# EAGLE board LaserCutter (EAGLE 6.2)
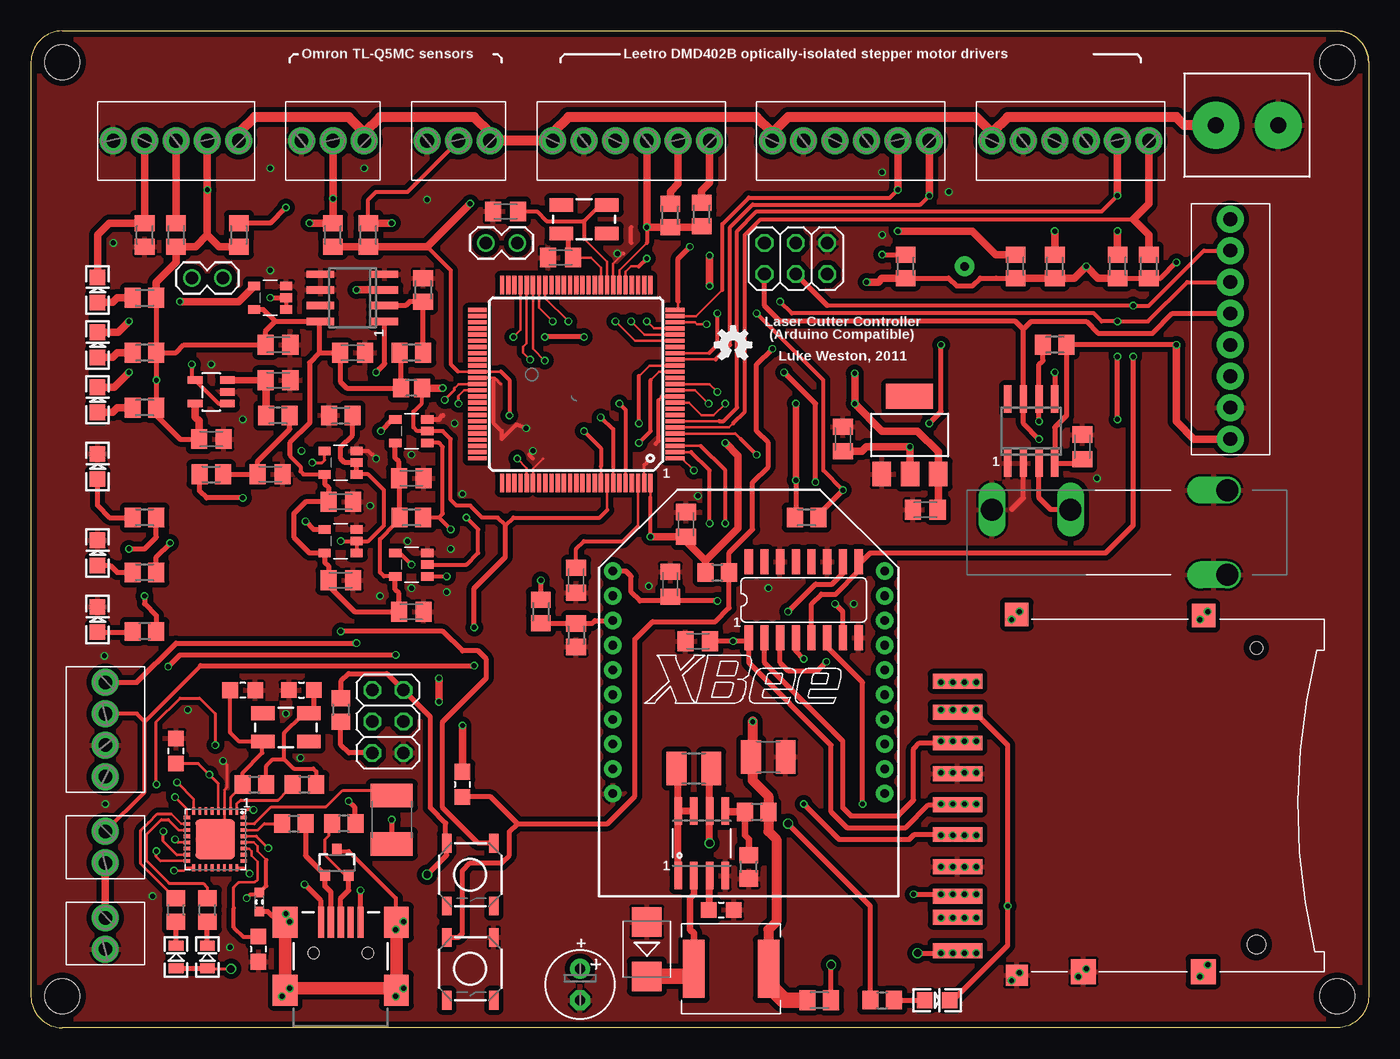
[diagram p5: board, top side]
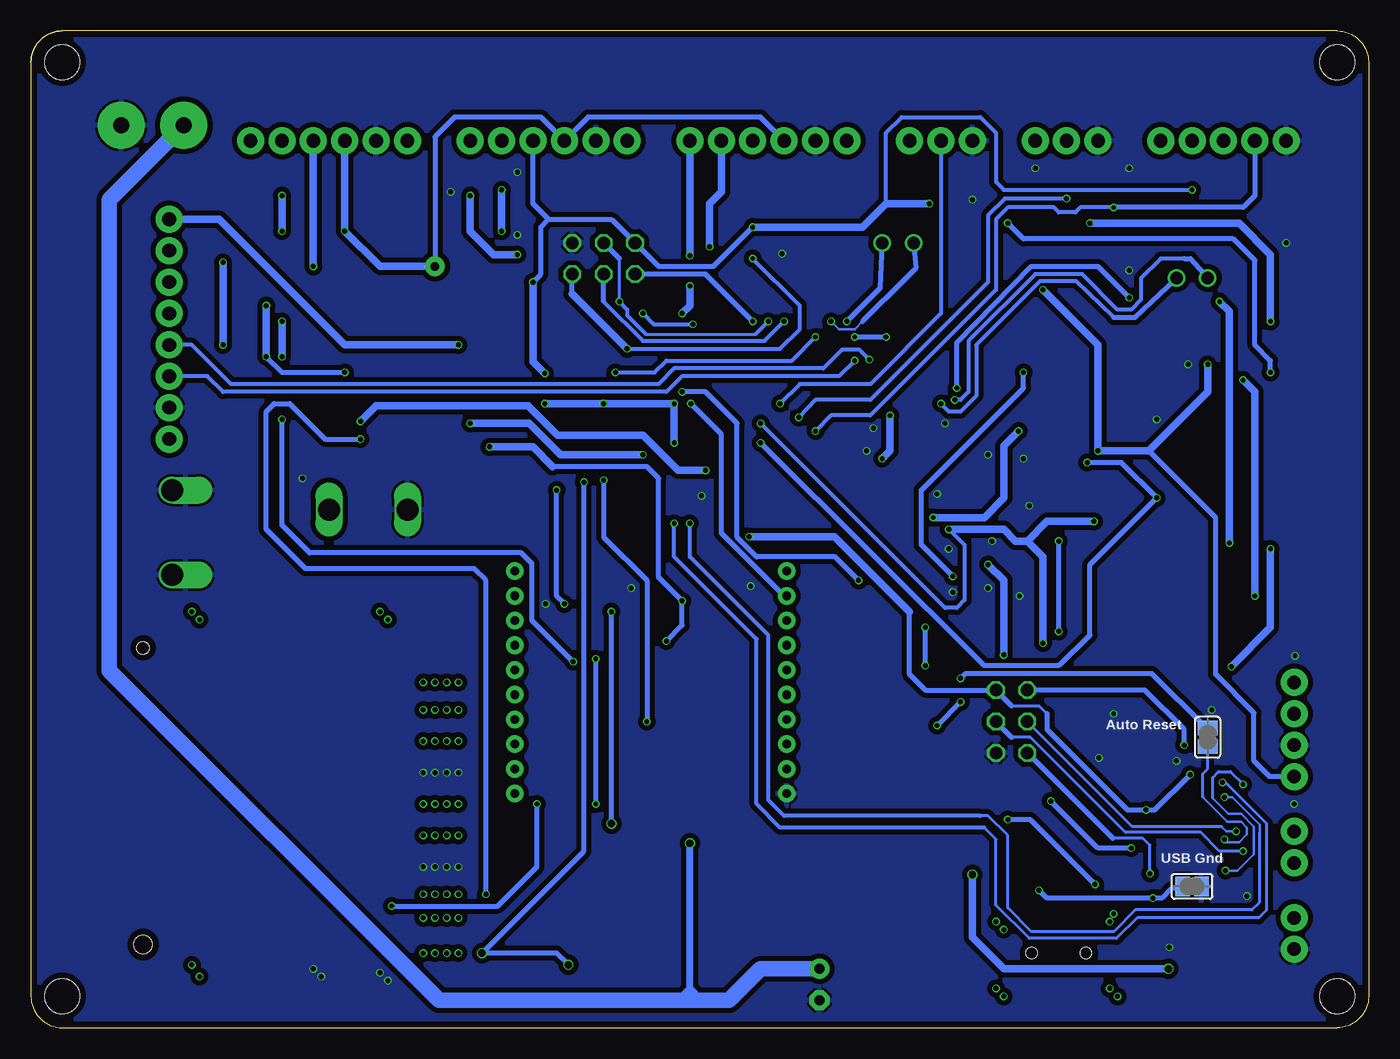
[diagram p6: board, bottom side, seen from below]

Size 108.27 x 80.64 mm. Coordinates in mm from the lower left corner, seen from the top.
Outline: 108.27,78.11 arc90 105.73,80.64
Outline: 105.73,80.64 arc-90 108.27,78.11
Outline: 108.27,78.11 108.27,2.54 arc-90 105.73,0 2.54,0 arc-90 0,2.54 0,78.11 arc-90 2.54,80.64 105.73,80.64
Copper layers (1*16): Top 0.035mm / dielectric 1.5mm / Bottom 0.035mm
Design rules: minimum track width 8mil, minimum drill 0.3mm, track to track 8mil, track to pad 8mil, pad to pad 8mil, via to via 8mil, smd to smd 8mil, copper to edge 20mil, drill to drill 8mil, minimum pad ring 8mil, minimum via ring 4mil, stop-mask expansion 3mil, vias tented up to drill 25mil, thermal gap 8mil
Holes 2.8 mm at 2.54,2.54 105.73,2.54 2.54,78.11 105.73,78.11

## Footprints (pad centres in the part's own frame; a part is rotated, then mirrored left to right if it is on the bottom)
0805-LARGE = smd 1.27 x 1.27: 1 -1.016,0; 2 1.016,0
C0805K = smd 1.3 x 1.6: 1 -1,0; 2 1,0
E2,5-6 = drill 0.813 pad 1.6: + -1.27,0 | drill 0.813 pad 1.6 octagon: - 1.27,0
C1210 = smd 1.6 x 2.7: 1 -1.4,0; 2 1.4,0
SMB = smd 2.4 x 2.4: A 2.2,0; C -2.2,0
1812 = smd 1.9 x 3.4: 1 -1.95,0; 2 1.95,0
ATMEL_QFN32 = smd 0.6 x 0.3: 1 -2.3,1.75; 2 -2.3,1.25; 3 -2.3,0.75; 4 -2.3,0.25; 5 -2.3,-0.25; 6 -2.3,-0.75; 7 -2.3,-1.25; 8 -2.3,-1.75; 17 2.3,-1.75; 18 2.3,-1.25; 19 2.3,-0.75; 20 2.3,-0.25; 21 2.3,0.25; 22 2.3,0.75; 23 2.3,1.25; 24 2.3,1.75 | smd 0.3 x 0.6: 9 -1.75,-2.3; 10 -1.25,-2.3; 11 -0.75,-2.3; 12 -0.25,-2.3; 13 0.25,-2.3; 14 0.75,-2.3; 15 1.25,-2.3; 16 1.75,-2.3; 25 1.75,2.3; 26 1.25,2.3; 27 0.75,2.3; 28 0.25,2.3; 29 -0.25,2.3; 30 -0.75,2.3; 31 -1.25,2.3; 32 -1.75,2.3 | smd 3.2 x 3.2: EXP 0,0
XBEE-PRO = drill 0.7 pad 1.422: 1 -11,10.27; 2 -11,8.27; 3 -11,6.27; 4 -11,4.27; 5 -11,2.27; 6 -11,0.27; 7 -11,-1.73; 8 -11,-3.73; 9 -11,-5.73; 10 -11,-7.73; 11 11,-7.73; 12 11,-5.73; 13 11,-3.73; 14 11,-1.73; 15 11,0.27; 16 11,2.27; 17 11,4.27; 18 11,6.27; 19 11,8.27; 20 11,10.27
SO08 = smd 0.61 x 2.21: 1 -1.905,-2.616; 2 -0.635,-2.616; 3 0.635,-2.616; 4 1.905,-2.616; 5 1.905,2.616; 6 0.635,2.616; 7 -0.635,2.616; 8 -1.905,2.616
SOT23-5 = smd 0.69 x 0.99: 1 -0.95,-1.29; 2 0,-1.29; 3 0.95,-1.29; 4 0.95,1.3; 5 -0.95,1.3
TQFP100 = smd 1.5 x 0.35: 1 -8,6; 2 -8,5.5; 3 -8,5; 4 -8,4.5; 5 -8,4; 6 -8,3.5; 7 -8,3; 8 -8,2.5; 9 -8,2; 10 -8,1.5; 11 -8,1; 12 -8,0.5; 13 -8,0; 14 -8,-0.5; 15 -8,-1; 16 -8,-1.5; 17 -8,-2; 18 -8,-2.5; 19 -8,-3; 20 -8,-3.5; 21 -8,-4; 22 -8,-4.5; 23 -8,-5; 24 -8,-5.5; 25 -8,-6; 51 8,-6; 52 8,-5.5; 53 8,-5; 54 8,-4.5; 55 8,-4; 56 8,-3.5; 57 8,-3; 58 8,-2.5; 59 8,-2; 60 8,-1.5; 61 8,-1; 62 8,-0.5; 63 8,0; 64 8,0.5; 65 8,1; 66 8,1.5; 67 8,2; 68 8,2.5; 69 8,3; 70 8,3.5; 71 8,4; 72 8,4.5; 73 8,5; 74 8,5.5; 75 8,6 | smd 0.35 x 1.5: 26 -6,-8; 27 -5.5,-8; 28 -5,-8; 29 -4.5,-8; 30 -4,-8; 31 -3.5,-8; 32 -3,-8; 33 -2.5,-8; 34 -2,-8; 35 -1.5,-8; 36 -1,-8; 37 -0.5,-8; 38 0,-8; 39 0.5,-8; 40 1,-8; 41 1.5,-8; 42 2,-8; 43 2.5,-8; 44 3,-8; 45 3.5,-8; 46 4,-8; 47 4.5,-8; 48 5,-8; 49 5.5,-8; 50 6,-8; 76 6,8; 77 5.5,8; 78 5,8; 79 4.5,8; 80 4,8; 81 3.5,8; 82 3,8; 83 2.5,8; 84 2,8; 85 1.5,8; 86 1,8; 87 0.5,8; 88 0,8; 89 -0.5,8; 90 -1,8; 91 -1.5,8; 92 -2,8; 93 -2.5,8; 94 -3,8; 95 -3.5,8; 96 -4,8; 97 -4.5,8; 98 -5,8; 99 -5.5,8; 100 -6,8
SO16 = smd 0.66 x 2.032: 1 -4.445,-3.073; 2 -3.175,-3.073; 3 -1.905,-3.073; 4 -0.635,-3.073; 5 0.635,-3.073; 6 1.905,-3.073; 7 3.175,-3.073; 8 4.445,-3.073; 9 4.445,3.073; 10 3.175,3.073; 11 1.905,3.073; 12 0.635,3.073; 13 -0.635,3.073; 14 -1.905,3.073; 15 -3.175,3.073; 16 -4.445,3.073
SOT223 = smd 1.499 x 2.007: 1 -2.261,-3.15; 2 0.025,-3.15; 3 2.311,-3.15 | smd 3.81 x 2.007: 4 0,3.15
SOT23-5' = smd 0.6 x 1.2: 1 -0.95,-1.306; 2 0,-1.306; 3 0.95,-1.306; 4 0.95,1.306; 5 -0.95,1.306
SO08' = smd 0.6 x 2.2: 1 -1.905,-2.6; 2 -0.635,-2.6; 3 0.635,-2.6; 4 1.905,-2.6; 5 1.905,2.6; 6 0.635,2.6; 7 -0.635,2.6; 8 -1.905,2.6
SOIC8-2 = smd 0.6 x 2.2: 1 -1.905,-2.6; 2 -0.635,-2.6; 3 0.635,-2.6; 4 1.905,-2.6; 5 1.905,2.6; 6 0.635,2.6; 7 -0.635,2.6; 8 -1.905,2.6
6POL254 = drill 1.1 pad 2.184: 1 -6.35,0; 2 -3.81,0; 3 -1.27,0; 4 1.27,0; 5 3.81,0; 6 6.35,0
SJ = smd 1.168 x 1.6: 1 -0.762,0; 2 0.762,0
USB-MINIB-FT = smd 2.5 x 0.5: D+ 2.5,0; D- 2.5,0.8; GND 2.5,-1.6; ID 2.5,-0.8; VBUS 2.5,1.6 | smd 2.5 x 2: SH1 -3,-4.5; SH2 -3,4.5; SH3 2.5,4.5; SH4 2.5,-4.5 | hole 0.9: 0,2.2; 0,-2.2
2X03 = drill 1.016 octagon: 1 -2.54,-1.27; 2 -2.54,1.27; 3 0,-1.27; 4 0,1.27; 5 2.54,-1.27; 6 2.54,1.27
1,6/0,8 = drill 0.7 pad 1.6: 1 0,0
4POL254 = drill 1.1 pad 2.184: 1 -3.81,0; 2 -1.27,0; 3 1.27,0; 4 3.81,0
W237-132 = drill 1.3 pad 3.81: 1 -2.54,0; 2 2.54,0
8POL254 = drill 1.1 pad 2.184: 1 -8.89,0; 2 -6.35,0; 3 -3.81,0; 4 -1.27,0; 5 1.27,0; 6 3.81,0; 7 6.35,0; 8 8.89,0
1X02 = drill 1.016: 1 0,0; 2 2.54,0
SDCARD = smd 1.2 x 4: 1 6.8,0.89; 2 4.3,0.89; 3 1.8,0.89; 4 -0.7,0.89; 5 -3.1,0.89; 6 -5.7,0.89; 7 -8.1,0.89; 8 -9.8,0.89; 9 9.3,0.89; CD -12.5,0.89 | smd 2.032 x 2.032: COM -14.2,-9.3; WP -14.2,-19 | smd 1.7 x 1.8: MT1 -14.5,-3.91 | smd 1.9 x 1.9: MT2 14.7,-3.91; MT3 14.6,-19.01 | hole 1.5: -12,-23.31 | hole 1: 12,-23.31
3POL254 = drill 1.1 pad 2.184: 1 -2.54,0; 2 0,0; 3 2.54,0
5POL254 = drill 1.1 pad 2.184: 1 -5.08,0; 2 -2.54,0; 3 0,0; 4 2.54,0; 5 5.08,0
2POL254 = drill 1.1 pad 2.184: 1 -1.27,0; 2 1.27,0
PCC-SMP-V = drill 1.778 offset: P$1 -4.013,-5.08; P$2 2.845,-5.08 | drill 1.778 long: T+ 1.27,7.62; T- 1.27,13.97
0603 = smd 0.762 x 0.762: 1 -0.762,0; 2 0.762,0
CR75 = smd 1.75 x 4.7: P$1 0,0; P$2 6.05,0
LED-0805 = smd 0.8 x 1.2: A -0.9,0; C 0.9,0
LED-0805-LARGE = smd 1.27 x 1.27: A -1.016,0; C 1.016,0
CRYSTAL-SMD-5X3 = smd 1.9 x 1.1: 1 -1.85,-1.15; 2 1.85,-1.15; 3 1.85,1.15; 4 -1.85,1.15
R0805 = smd 1.3 x 1.5: 1 -0.95,0; 2 0.95,0
M0805 = smd 1.3 x 1.6: 1 -0.95,0; 2 0.95,0
R1210 = smd 1.6 x 2.7: 1 -1.4,0; 2 1.4,0
R0805' = smd 1.3 x 1.5: 1 -0.85,0; 2 0.85,0
TACTILE_SWITCH_SMD = smd 1.524 x 0.762: 1 -2.54,1.905; 2 2.54,1.905; 3 -2.54,-1.905; 4 2.54,-1.905
SOT23-3 = smd 0.8 x 0.9: 1 -0.95,-1; 2 0.95,-1; 3 0,1.1

## Placement (x,y rotation side)
$1  OSHW-LOGOS  [OSHW-LOGO-S]  56.83,55.24 0 top
C1  22pF  [0805-LARGE]  17.14,27.3 180 top
C2  22pF  [0805-LARGE]  21.9,27.31 0 top
C3  100nF  [0805-LARGE]  34.92,19.68 270 top
C4  100nF  [C0805K]  51.75,35.88 90 top
C5  100nF  [0805-LARGE]  11.75,22.38 90 top
C6  1uF  [0805-LARGE]  18.41,6.35 270 top
C7  22pF  [C0805K]  38.42,66.04 0 top
C8  22pF  [C0805K]  42.86,62.31 0 top
C9  100 uF  [E2,5-6]  44.45,3.49 270 top
C10  47 uF  [C1210]  59.69,21.91 0 top
C11  100 pF  [0805-LARGE]  55.88,9.53 0 top
C12  100nF  [C0805K]  53.02,40.72 270 top
C13  100nF  [C0805K]  44.13,36.2 90 top
C14  100nF  [C0805K]  72.39,41.91 180 top
C15  10 uF  [C0805K]  65.72,47.62 90 top
C16  100nF  [C0805K]  53.98,31.27 180 top
C17  100nF  [C0805K]  19.37,44.77 0 top
C18  100nF  [C0805K]  20,52.39 0 top
C19  100nF  [C0805K]  85.09,46.99 90 top
C20  100nF  [C0805K]  20,55.24 0 top
C21  100nF  [C0805K]  30.8,44.45 0 top
C22  100nF  [C0805K]  30.8,33.66 0 top
C23  100nF  [C0805K]  25.08,36.2 0 top
C24  100nF  [C0805K]  25.08,42.55 0 top
C25  100nF  [C0805K]  14.61,47.62 0 top
C26  100nF  [C0805K]  26.04,54.61 0 top
D1  CDBB260  [SMB]  49.85,6.35 90 top
F1  500 mA  [1812]  29.21,16.83 90 top
IC1  ATMEGA8U2  [ATMEL_QFN32]  14.92,15.24 270 top
IC2  BEE module  [XBEE-PRO]  58.1,26.67 0 top
IC3  MC34063  [SO08]  54.29,14.92 0 top
IC4  74AHC1G02DBV  [SOT23-5]  19.37,59.05 90 top
IC5  74AHC1G08DBV  [SOT23-5]  30.8,37.47 90 top
IC6  ATMEGA2560-16AU  [TQFP100]  44.13,52.07 180 top
IC7  CD4050D  [SO16]  62.55,34.61 0 top
IC8  LD1117S33  [SOT223]  71.12,47.94 0 top
IC9  OPA340N  [SOT23-5']  14.61,51.44 90 top
IC10  LM393D  [SO08']  26.04,59.05 90 top
IC11  74AHC1G02DBV  [SOT23-5]  25.08,39.37 90 top
IC12  74AHC1G02DBV  [SOT23-5]  30.8,48.26 90 top
IC13  74AHC1G08DBV  [SOT23-5]  25.08,45.72 90 top
IC14  MAX6675  [SOIC8-2]  80.96,48.26 0 top
J1  X Stepper  [6POL254]  48.58,71.75 180 top
J2  Reset En  [SJ]  13.02,23.5 90 bottom
J3  USB  [USB-MINIB-FT]  25.08,6.03 90 top
J4  Y Stepper  [6POL254]  66.36,71.75 180 top
J5  Ground  [SJ]  14.29,11.43 0 bottom
J6  ISP  [2X03]  28.89,24.77 270 top
J7  Z Stepper  [6POL254]  84.14,71.75 180 top
J8  Stepper disable  [1,6/0,8]  75.56,61.59 0 top
J9  Laser HV PSU  [4POL254]  6.03,24.13 270 top
J10  24V in  [W237-132]  98.43,73.03 0 top
J11  Interface  [8POL254]  97.08,56.51 90 top
J12  I2C  [1X02]  39.37,63.5 180 top
J13  SDMMC18650  [SDCARD]  75.88,18.73 90 top
J14  ISP  [2X03]  61.91,62.23 0 top
J15  UART3  [1X02]  13.02,60.64 0 top
J16  X Home  [3POL254]  34.61,71.75 180 top
J17  Z Home  [5POL254]  11.75,71.75 180 top
J18  Y Home  [3POL254]  24.45,71.75 180 top
J19  Interlocks  [2POL254]  6.03,14.61 270 top
J20  Spare  [2POL254]  6.03,7.62 270 top
J21  Omega PCC-SMP-V-K  [PCC-SMP-V]  91.76,40.64 90 top
L1  L1: 0603 Ferrite bead  [0603]  18.49,10.16 90 top
L2  33 uH  [CR75]  53.66,4.76 0 top
LED1  TXD  [LED-0805]  14.29,5.71 90 top
LED2  RXD  [LED-0805]  11.75,5.72 90 top
LED3  Power  [LED-0805-LARGE]  5.4,33.02 90 top
LED4  Laser On  [LED-0805-LARGE]  5.4,45.4 90 top
LED5  Interlocks  [LED-0805-LARGE]  5.4,38.42 90 top
LED6  SDBusy  [LED-0805-LARGE]  73.34,2.22 0 top
LED7  XHome  [LED-0805-LARGE]  5.4,50.8 90 top
LED8  ZHome  [LED-0805-LARGE]  5.4,59.69 90 top
LED9  YHome  [LED-0805-LARGE]  5.4,55.24 90 top
Q1  16 MHz  [CRYSTAL-SMD-5X3]  20.64,24.29 180 top
Q2  16MHz  [CRYSTAL-SMD-5X3]  44.77,65.41 0 top
R1  10k  [R0805]  25.08,25.72 270 top
R2  10k  [M0805]  51.75,65.72 270 top
R3  10k  [M0805]  82.87,61.59 270 top
R4  10k  [M0805]  54.29,65.8 270 top
R5  10k  [M0805]  70.8,61.59 270 top
R6  10k  [M0805]  79.69,61.59 270 top
R7  10k  [M0805]  90.49,61.59 270 top
R8  10k  [M0805]  87.95,61.59 270 top
R9  1M  [R0805]  18.1,19.68 0 top
R10  5k6  [M0805]  41.27,33.66 90 top
R11  27R  [R0805]  22.15,19.68 0 top
R12  10k  [M0805]  44.13,31.75 90 top
R13  1k  [R0805]  14.29,9.53 90 top
R14  22R  [R0805]  21.27,16.51 0 top
R15  1k  [R0805]  11.75,9.53 90 top
R16  22 R  [R0805]  25.32,16.51 180 top
R17  10k  [R0805]  55.56,36.83 0 top
R18  0.2 ohm  [R1210]  53.66,20.95 180 top
R19  1k  [R0805]  9.21,32.07 180 top
R20  1k  [R0805]  58.1,13.02 90 top
R21  3k0  [R0805]  58.74,17.46 0 top
R22  1k  [M0805]  9.21,41.27 0 top
R23  1k  [M0805]  9.21,36.83 0 top
R24  10k  [M0805]  63.82,2.22 0 top
R25  10k  [M0805]  62.79,41.27 0 top
R26  1k  [R0805]  68.9,2.22 0 top
R27  1k  [M0805]  9.21,50.16 0 top
R28  10k  [R0805']  30.8,51.75 180 top
R29  10k  [M0805]  30.8,41.27 0 top
R30  10k  [M0805]  30.8,54.61 0 top
R31  10k  [M0805]  27.3,64.14 270 top
R32  10k  [M0805]  24.45,64.14 270 top
R33  1k  [M0805]  9.21,54.61 0 top
R34  220R  [M0805]  11.75,64.14 90 top
R35  10k  [M0805]  16.83,64.14 90 top
R36  1k  [M0805]  9.21,59.05 180 top
R37  1k  [M0805]  14.61,44.77 180 top
R38  1k  [M0805]  20,49.53 0 top
R39  DNP  [M0805]  9.21,64.14 270 top
R40  10k  [M0805]  82.87,55.24 0 top
R41  1k  [M0805]  31.75,59.69 90 top
R42  10k  [M0805]  25.08,49.53 180 top
S1  Reset  [TACTILE_SWITCH_SMD]  35.56,4.76 270 top
S2  Laser Test  [TACTILE_SWITCH_SMD]  35.56,12.38 270 top
U$  OSHW-LOGOS  [OSHW-LOGO-S]  56.83,55.24 0 top
U$1  OSHW-LOGOS  [OSHW-LOGO-S]  56.83,55.24 0 top
U$2  OSHW-LOGOS  [OSHW-LOGO-S]  56.83,55.24 0 top
U$3  OSHW-LOGOS  [OSHW-LOGO-S]  56.83,55.24 0 top
Z1  PGB102ST23  [SOT23-3]  24.77,13.34 0 top

## Tracks (layer width: path | path; a pad name or v marks a point on that pad's centre or on a via)
8U2_MISO  (via drill 0.4)
  Top 0.203: IC1.17 12.62,12.94 12.38,12.7 v11.59,12.7
  Top 0.254: v10.16,19.68 10.16,24.77 12.06,26.67 13.65,26.67 14.92,25.4 v14.92,22.86
  Bottom 0.203: v11.59,12.7 10.64,12.7 9.29,14.05 9.29,16.27 10.32,17.3 11.35,17.3 12.62,18.57
  Bottom 0.254: v10.16,19.68 11.19,20.72 12.14,20.72 12.62,20.24 12.62,18.57
  Bottom 0.406: v14.92,22.86 14.92,24.13 18.1,27.3 J6.1
8U2_MOSI  (via drill 0.4)
  Top 0.203: IC1.16 10.48,13.49
  Top 0.254: 10.48,13.49 10.16,13.81 v10.16,14.29
  Bottom 0.254: v10.16,14.29 12.06,14.29 13.57,15.8 19.68,15.8 27.38,23.5 28.89,23.5
  Bottom 0.406: 28.89,23.5 J6.4
8U2_SCK  (via drill 0.4)
  Top 0.203: IC1.15 11.81,13.99
  Top 0.254: 11.81,13.99 10.72,15.08 v10.72,15.88
  Bottom 0.203: 11.91,16.27 11.51,15.88 10.87,15.88
  Bottom 0.254: v10.72,15.88 10.87,15.88 | 11.91,16.27 19.13,16.27 J6.3
!8U2_RESET  (via drill 0.4)
  Top 0.203: IC1.24 17.22,12.94 v17.7,12.46
  Top 0.406: R1.2 25.08,22.86 25.72,22.23 J6.5
  Bottom 0.254: 20.72,15.32 18.26,15.32 17.7,14.76 v17.7,12.46
  Bottom 0.406: 20.72,15.32 J6.5
!DOOR  (via drill 0.4)
  Top 0.203: 46.63,41.87 IC6.93
  Top 0.305: 9.21,24.77 9.21,19.05 J19.1 | 9.21,24.77 8.57,25.4 J9.2 | R28.1 31.65,50.54 30.96,49.85 30.96,48.58 31.27,48.26 IC12.2 33.34,48.26 33.97,47.62 33.97,42.7 34.45,42.23 35.56,42.23 36.51,41.27 37.78,41.27 38.42,40.64 39.05,41.27 46.04,41.27 46.63,41.87 | 9.21,24.77 13.73,29.29 | IC4.2 IC4.1
  Top 0.406: 38.42,40.64 38.42,38.1 35.88,35.56 v35.88,32.38 | 13.73,29.29 v35.88,29.29 | v19.37,59.05 IC4.2
  Top 0.61: R28.1 v33.34,51.75
  Bottom 0.406: v33.34,51.75 33.34,55.4 27.3,61.59 21.91,61.59 v19.37,59.05 | v35.88,29.29 v35.88,32.38
!LASER_ENABLE  (via drill 0.4)
  Top 0.203: IC6.16 50.08,53.57 49.21,52.7
  Top 0.305: 33.02,41.27 R29.2 | 33.02,41.27 33.34,41.59 33.34,46.99 33.02,47.31 IC12.1 | v33.97,40.32 33.02,41.27 | v49.21,48.9 49.21,52.7
  Top 0.406: IC11.4 22.86,40.32 v22.23,40.96 | v26.35,31.11 11.75,31.11 8.57,27.94 J9.1
  Bottom 0.305: v33.97,40.32 32.7,39.05 32.7,34.61 33.34,33.97 34.29,33.97 v49.21,48.9
  Bottom 0.61: v22.23,40.96 26.04,40.96 27.62,39.37 | 27.62,39.37 26.35,38.1 v26.35,31.11 | 27.62,39.37 28.57,39.37 29.53,40.32 v33.97,40.32
!RESET  (via drill 0.4)
  Top 0.203: IC6.30 48.13,61.15 48.58,61.59 49.21,61.59
  Top 0.305: R17.2 | v49.85,62.23 49.21,61.59
  Top 0.406: R17.2 56.52,33.97 55.4,32.86 50.32,32.86 48.9,31.43 48.9,18.73 46.67,16.51 39.37,16.51 | v60.01,54.93 58.74,53.66 58.74,48.26 59.69,47.31 59.69,45.4 58.42,44.13 58.42,40.32 56.51,38.41 R17.2 | S1.3 34.61,7.3 34.92,7.62 34.92,12.7 35.56,13.34 38.1,13.34 38.73,13.97 38.73,15.88 39.37,16.51 | C3.2 37.21,18.67 39.37,16.51
  Bottom 0.305: v49.85,62.23 46.04,58.42 46.04,56.52 47.62,54.93 v60.01,54.93
  Bottom 0.406: 64.45,59.37 J14.5
  Bottom 0.61: v60.01,54.93 64.45,59.37
!SD_CD  (via drill 0.4, 0.6)
  Top 0.203: IC6.47 39.63,56.46 v39.05,55.88
  Top 0.406: v60.96,53.02 63.5,50.48 v63.5,44.13 | v44.77,55.88 v41.59,55.88 | v71.75,6.03 v73.66,6.03 v74.61,6.03 74.79,6.03 | 74.79,6.03 J13.CD | R24.2 v64.77,5.08 | 74.79,6.03 v75.56,6.03 v76.52,6.03
  Bottom 0.305: v60.96,53.02 57.78,53.02 56.83,53.98 46.67,53.98 v44.77,55.88
  Bottom 0.406: v41.59,55.88 v39.05,55.88 | v63.5,44.13 63.5,14.29 v71.75,6.03 65.72,6.03 v64.77,5.08
!SD_CS  (via drill 0.4)
  Top 0.203: IC6.23 53.74,57.07 53.9,56.91 v54.69,56.91
  Top 0.305: v58.74,57.78 64.14,52.39 64.14,45.09 v65.72,43.5
  Top 0.406: IC7.7 65.72,33.66 v65.09,34.29 | R25.2 63.74,41.51 v65.72,43.5
  Bottom 0.305: v54.69,56.91 57.86,56.91 v58.74,57.78
  Bottom 0.406: v65.72,43.5 65.72,34.92 v65.09,34.29
!THERM_CS  (via drill 0.4)
  Top 0.203: 52.67,46.07 v53.66,45.09
  Top 0.305: IC6.1 52.67,46.07 | R40.1
  Top 0.406: R40.1 81.92,53.98 81.6,53.66 IC14.6 v81.6,49.05
  Bottom 0.61: v53.66,45.09 55.88,45.09 58.74,47.94 65.64,47.94 68.02,50.32 80.33,50.32 v81.6,49.05
!UI_CS  (via drill 0.4)
  Top 0.203: IC6.5 57.02,48.07
  Top 0.254: 57.02,48.07 57.47,47.62
  Top 0.305: 57.47,47.62 v58.74,46.35
  Top 0.406: v72.71,48.9 73.66,49.85 v73.66,55.24
  Bottom 0.61: v73.66,55.24 82.87,55.24 93.03,65.41 96.76,65.41 J11.8 | v72.71,48.9 67.94,48.9 65.41,46.35 v58.74,46.35
+3V3  (via drill 0.4)
  Top 0.406: C16.1 55.09,31.27 55.24,31.43 | C16.1 v56.83,31.27 57.84,31.27 IC7.1 58.05,31.3 58.05,31.38 58.1,31.43 58.1,29.53 64.77,22.86 64.77,17.46 66.04,16.19 70.8,16.19 72.64,18.03 J13.4 | C16.1 | IC2.1 48.15,36.94 48.58,36.51 48.58,35.24 49.29,34.53 51.4,34.53 C4.1 | C4.1 51.8,34.92 | v55.56,34.53 52.1,34.53 C4.1 | v73.66,18.1 v74.61,18.1 74.61,18.03 J13.4 | J13.4 75.56,18.03 v75.56,18.1 v76.52,18.1
  Top 0.61: C15.1 67.26,46.62 67.63,46.99 v71.14,46.99 IC8.2
  Bottom 0.406: 66.04,45.4 58.42,45.4 57.47,44.45 57.47,36.43 v55.56,34.53 55.56,32.54 v56.83,31.27
  Bottom 0.61: v71.14,46.99 70.17,46.99 67.63,46.99 66.04,45.4
+5V  (via drill 0.4, 0.6)
  Top 0.203: 34.56,53.07 IC6.61 38.05,53.07 | IC6.80 40.13,45.27 v39.37,46.04 | IC6.31 47.63,61.28 49.85,63.5 | IC6.10 53.25,50.57 54.29,49.53 55.24,49.53 v56.2,50.48 | IC1.32 17.22,17.38 17.46,17.62 | 15.17,19.75 IC1.4 | 50.13,42.9 IC6.100
  Top 0.254: v18.02,17.62 17.46,17.62 | v14.45,20.48 15.16,19.76 15.16,19.77 15.08,19.84 | 15.17,19.75 14.76,20.16 | 15.17,19.75 | v14.45,20.48 15.17,19.75 | 13.56,21.37 C5.1 13.56,21.37 | v14.45,20.48 13.56,21.37 | v14.45,20.48 13.56,21.37 | LED1.A 14.34,4.76 v16.19,4.76
  Top 0.305: 34.56,53.07 33.97,53.66 33.97,61.28 32.07,63.18 32.07,63.19 | R30.1 29.95,54.51 | 29.85,44.4 C21.1 | C26.1 25.04,54.56 25.08,54.61 | IC5.5 28.57,36.52 28.26,36.83 28.26,39.53 29.53,40.8 29.53,40.95 R29.1 | IC9.5 | IC4.5 | IC10.8 23.34,57.05 | 10.48,50.16 R27.2 9.84,50.16 9.84,50.48 10.16,50.8 | 10.16,52.71 v10.16,52.39 | R17.1 | R2.2 | 54.53,64.77 R4.2 | v49.85,64.77 49.85,63.5 | R5.2 | C12.2 53.02,39.37 | v66.67,50.48 v66.67,52.94 | 20.95,46.35 20.95,46.28 21.83,45.4 21.83,45.01 22.07,44.77 IC13.5 | v50.13,39.72 50.13,42.9 | v38.73,49.53 38.73,52.39 38.05,53.07
  Top 0.406: R8.2 R7.2 91.44,60.65 v92.71,61.91 | R6.2 78.11,60.65 76.83,60.64 76.2,60.01 74.93,60.01 74.3,60.64 R5.2 | R36.1 R33.2 | C21.1 29.8,45.77 29.5,46.07 IC12.5 | IC5.5 29.5,35.43 29.8,35.13 C22.1 26.19,33.66 24.08,35.77 C23.1 24.08,37.35 23.78,37.65 IC11.5 22.54,38.42 21.27,39.69 21.27,41.59 22.23,42.55 C24.1 24.08,43.7 23.78,44 IC13.5 | R29.1 29.85,44.4 | 29.95,54.51 R28.2 25.56,51.75 25.04,52.28 25.04,54.56 | 19.76,57.15 IC10.8 | 19.76,57.15 19,56.39 C20.1 12.38,55.24 11.75,54.61 R33.2 | 19.76,57.15 18.81,58.1 IC4.5 | 20.95,46.35 20.95,47.31 22.54,48.9 22.54,53.82 23.34,54.61 | 23.34,54.61 C26.1 | 23.34,57.05 23.34,54.61 | R27.2 10.16,49.53 12.06,47.62 C25.1 | R33.2 10.16,52.71 | v10.16,52.39 10.16,50.8 | R1.1 25.08,28.02 25.72,28.65 28.81,28.65 J6.2 32.35,25.12 32.35,17.78 33.58,16.55 33.58,14.84 | LED2.A LED1.A | LED1.A | v92.71,55.24 R40.2 83.82,49.53 82.87,48.58 IC14.4 85.3,45.66 C19.1 | R25.1 61.84,41.67 61.91,41.75 v61.91,44.29 | 73.43,41.63 C14.1 | v9.21,34.92 9.21,34.29 10.16,33.34 R19.1 | 33.58,14.84 33.58,14.45 | 33.58,14.84 S2.3 33.66,13.97 v32.07,12.38
  Top 0.508: v61.91,50.48 v61.91,44.29
  Top 0.61: R8.2 86.36,60.65 v85.41,61.59 84.46,60.65 R3.2 R6.2 | v92.71,55.24 92.71,49.05 94.14,47.62 96.76,47.62 J11.1 | J17.2 v14.29,67.79 14.29,64.14 | 14.29,64.14 13.34,63.19 R34.1 11.75,61.91 10.16,60.32 R36.1 | C25.1 13.61,49.1 13.3,49.41 IC9.5 | R32.2 R31.2 32.07,63.19 v35.56,66.67 | R2.2 v49.85,64.77 J1.3 | R2.2 54.53,64.77 | R35.1 15.24,63.19 14.29,64.14 | R5.2 68.9,60.64 68.58,60.33 v67.63,60.33 | 54.61,37.78 R17.1 | 54.61,37.78 57.23,40.4 57.23,46.28 v56.2,47.31 | v50.13,39.72 C12.2 | 53.02,39.37 54.61,37.78 | v66.67,52.94 v66.67,50.48 68.9,48.26 71.75,48.26 73.43,46.58 IC8.3 73.43,41.63
  Top 0.813: L2.P$2 59.7,6.03 | 59.7,6.03 59.69,6.65 59.69,5.08 60.01,4.76 | 59.71,5.4 59.69,5.42 | R21.2 | 59.69,3.49 59.69,4.75 L2.P$2 | 59.7,6.03 59.69,6.04 | R21.2 59.69,15.88 60.33,15.24 60.33,8.57 59.69,7.94 59.69,4.78 L2.P$2 | v58.42,24.77 58.42,22.04 C10.1 58.42,21.78 58.42,20 59.69,18.73 R21.2
  Top 1.27: R24.1 60.96,2.22 59.69,3.49 | L2.P$2 59.71,5.4 59.71,5.71
  Bottom 0.254: v14.45,20.48 14.29,20.64 | 26.04,25.4 26.67,26.04 28.89,26.04
  Bottom 0.305: v14.29,67.79 29.53,67.79 30.16,68.42 30.16,72.39 31.43,73.66 37.78,73.66 39.05,72.39 39.05,66.67
  Bottom 0.406: J4.3 67.63,66.67 66.36,65.41 | 66.36,65.41 61.28,65.41 J14.2 57.47,61.59 53.02,61.59 v49.85,64.77 | v67.63,60.33 66.99,60.96 66.99,64.77 66.36,65.41 | 37.15,33.66 37.15,28.57 35.88,27.3 J6.2 28.89,26.04 | v14.45,20.48 17.3,17.62 v18.02,17.62 19.53,17.62 26.04,24.13 26.04,25.4 | v61.91,44.29 61.91,39.69 58.42,36.2 v58.42,24.77
  Bottom 0.61: v85.41,61.59 J7.3 | v92.71,61.91 v92.71,55.24 | v9.21,34.92 9.21,51.44 v10.16,52.39 | v38.73,49.53 38.73,46.67 v39.37,46.04 | v50.13,39.72 43.21,39.72 37.15,33.66 | v56.2,47.31 v56.2,50.48 v61.91,50.48 v66.67,50.48 | v49.85,64.77 40.96,64.77 39.05,66.67 v35.56,66.67 | v67.63,60.33 67.63,53.9 v66.67,52.94 | v16.19,4.76 29.53,4.76 32.07,7.3 v32.07,12.38
+24V  (via drill 0.6)
  Top 0.559: v54.93,14.92 IC3.6 54.93,21.78 R18.1
  Top 0.813: 77.79,72.39 79.06,73.66 92.71,73.66 93.34,73.03 J10.1 | 77.79,72.39 J7.6 | 77.79,72.39 76.52,73.66 61.28,73.66 60.01,72.39 | 60.01,72.39 J4.6 | 60.01,72.39 58.74,73.66 43.5,73.66 42.23,72.39 J1.6 J16.1 37.15,72.39 35.88,73.66 28.26,73.66 26.99,72.39 | 26.99,72.39 J18.1 | 26.99,72.39 25.72,73.66 18.1,73.66 16.83,72.39 J17.1
  Bottom 0.559: 53.98,2.22 54.93,3.17 55.56,2.54 | 54.93,2.22 v54.93,14.92
  Bottom 1.27: C9.+ 49.21,4.76 51.75,2.22 53.98,2.22 54.93,2.22 75.25,2.22 101.92,28.89 101.92,66.99 J10.1 | J10.1 | J10.1
BEE_RXD  (via drill 0.4)
  Top 0.203: IC6.12 53.76,51.57 v54.85,50.48
  Bottom 0.406: IC2.2 47.32,34.94 52.39,40.01 52.39,48.02 v54.85,50.48
BEE_TXD  (via drill 0.4)
  Top 0.203: IC6.13 54.93,52.07 v55.56,51.44
  Top 0.406: R10.2 v41.27,36.2
  Bottom 0.406: v55.56,51.44 53.66,51.44 51.12,48.9 51.12,39.69 49.53,38.1 43.18,38.1 v41.27,36.2
DAT1  (via drill 0.4)
  Top 0.406: v73.66,8.89 v74.61,8.89 | v74.61,8.89 v75.56,8.89 | v75.56,8.89 74.99,8.89 J13.8 74.61,8.93 v74.61,8.89 | 75.63,8.93 75.56,8.93 | 75.56,8.93 75.25,8.93 | v76.52,8.89 v75.56,8.89 | v75.56,8.89 75.56,8.93
DAT2  (via drill 0.4)
  Top 0.406: v76.52,27.94 v75.56,27.94 75.56,28.03 J13.9 74.61,28.03 | 74.61,28.03 v74.61,27.94 | 74.61,28.03 73.66,28.03 v73.66,27.94
GND  (via drill 0.4)
  Top 0.203: IC6.81 40.63,45.24 41.43,46.04 | IC6.99 49.63,45.51 | IC6.32 47.13,61.82 47.94,62.63 | IC6.11 52.13,51.05 51.05,51.05 50.8,50.8 | 15.67,15.99 IC1.3 15.67,19.24 | 37.52,52.57 IC6.62
  Top 0.254: 15.67,15.99 IC1.EXP 13.97,14.29 | 15.67,19.24 15.88,19.45 15.88,21.27 v15.56,21.59 | 38.02,52.07 37.52,52.57 37.52,52.44
  Top 0.305: 40.63,46.05 40.32,46.35 | 49.63,45.51 49.85,45.72 | 48.58,63.5 48.58,64.77 | 47.94,62.63 v47.47,62.63 | 50.8,50.8 50.8,47.47 50.56,47.23 | IC13.3 27.31,46.67 27.62,46.35 | 37.52,52.44 37.47,52.39 37.47,48.9 38.1,48.26 38.1,47.62 39.29,48.82 v40.08,48.5
  Top 0.406: IC12.3 33.02,49.21 33.34,49.53 | IC14.2 80.33,42.86 79.38,41.91
  other vias: 74.3,67.63 6.67,63.5 17.14,49.21 27.94,46.04 27.46,42.23 33.66,35.24 30.8,35.56 28.26,34.92 30.8,46.35 34.92,43.18 33.97,38.73 30.48,39.37 5.95,30.08 34.29,48.9 19.37,61.28 14.61,53.66 68.9,64.14 53.98,43.02 26.99,69.53 19.37,69.53 32.07,66.99 68.89,69.21 12.7,25.72 6.03,18.1 16.11,6.51 9.84,10.64 20.64,25.4 21.83,21.83 40.64,46.67 59.69,35.56 66.6,34.29 50.01,35.72 86.28,44.45 74.61,13.02 75.56,13.02 76.52,13.02 73.66,13.02 73.66,20.64 76.52,20.64 74.61,20.64 75.56,20.64 80.01,4.45 79.38,3.81 84.77,4.13 85.41,4.76
  pour Top (isolate 0.406): 108.9,-0.64 -0.64,-0.64 -0.64,81.28 108.9,81.28
  pour Bottom (isolate 0.406): 108.9,-0.64 -0.64,-0.64 -0.64,81.28 108.9,81.28
J81  (via drill 0.4)
  Top 0.305: R3.1 82.87,64.14 v82.87,64.45
  Top 0.61: v82.87,64.45 R3.1
  Bottom 0.406: J8.1 75.56,72.07 73.98,73.66 66.99,73.66 J4.4 63.18,73.66 49.21,73.66 J1.4
  Bottom 0.61: J7.4 v82.87,64.45 80.01,61.59 J8.1
LASER_ENABLED  (via drill 0.4)
  Top 0.305: IC5.2 35.24,37.47 36.2,38.42 36.2,40.32 v35.24,41.27
  Top 0.406: v28.34,48.26 29.29,49.21 IC12.4
  Bottom 0.61: v28.34,48.26 29.53,47.07 29.53,42.86 31.11,41.27 v35.24,41.27
LASER_MODULATION  (via drill 0.4)
  Top 0.305: IC9.1 15.2,50.48 IC9.4 13.02,52.42 v13.02,53.66
  Top 0.61: v26.35,59.69 IC10.3
  Bottom 0.305: 17.78,46.67 | v21.91,46.67
  Bottom 0.406: 17.78,46.67 12.38,41.27 12.38,28.57 9.29,25.48 9.29,21.59 8.02,20.32 J9.4
  Bottom 0.61: v13.02,53.66 13.02,51.44 17.78,46.67 v21.91,46.67 21.91,55.24 v26.35,59.69
LASER_PWM  (via drill 0.4)
  Top 0.203: IC6.15 50.85,53.07 50.16,52.39
  Top 0.254: IC13.4 23.78,45.93 23.57,45.72 v22.78,45.72
  Top 0.305: 50.16,52.39 50.16,48.26 v49.21,47.31
  Top 0.406: R37.2 13.65,43.42 14.21,42.86 v17.14,42.86
  Bottom 0.406: v49.21,47.31 31.11,29.29 25.08,29.29 22.54,31.75 22.54,37.47 v17.14,42.86 20,45.72 v22.78,45.72
LASER_PWM_ON  (via drill 0.4)
  Top 0.305: IC5.1 v33.66,36.51 v33.65,36.52 IC5.1
  Top 0.406: v27.94,53.02 28.64,53.72 IC10.1
  Bottom 0.406: v27.94,53.02 27.94,51.75 36.2,43.5 36.2,39.05 v33.66,36.51
MISO  (via drill 0.4)
  Top 0.203: IC6.22 50.43,56.57 v49.85,57.15
  Top 0.406: 80.33,56.52 80.96,57.15 85.41,57.15 86.36,56.2 90.81,56.2 92.39,57.78 96.76,57.78 J11.5 | 80.33,56.52 79.69,57.15 60.64,57.15 59.37,58.42 J14.1 | 80.33,56.52 IC14.7 80.33,48.9 v81.6,47.62 | 74.83,10.79 v74.61,10.79 v73.66,10.79 v71.44,10.79 | 74.83,10.79 J13.7 75.56,10.63 v75.56,10.79 v76.52,10.79 | 74.83,10.79 74.93,10.79
  Bottom 0.406: v49.85,57.15 53.66,60.96 J14.1 | v81.6,47.62 84.45,47.62 87.31,50.48 88.58,50.48 89.22,49.85 89.22,40.32 86.04,37.15 72.39,37.15 71.44,36.2 v71.44,10.79
MOSI  (via drill 0.4)
  Top 0.203: IC6.21 49.66,56.07 v48.58,57.15
  Top 0.305: v60.64,58.74 61.59,57.78 86.04,57.78 86.68,57.15 v87.95,57.15 90.41,57.15 93.58,60.33 96.76,60.33 J11.6
  Top 0.406: v87.95,49.21 v87.95,54.29 | v64.37,29.61 63.66,28.89 61.28,28.89 60.64,29.53 IC7.3 60.64,31.75
  Bottom 0.254: 49.05,56.67 49.61,56.12 58.5,56.12 | v60.64,58.74 60.64,62.23
  Bottom 0.305: v48.58,57.15 | v48.58,57.15 49.37,56.36 49.61,56.12 | 58.5,56.12 60.01,57.63 60.01,58.1 v60.64,58.74
  Bottom 0.406: v64.37,29.61 67.71,32.94 67.71,37.54 68.58,38.42 85.72,38.42 87.95,40.64 v87.95,49.21 | J14.4 60.64,62.23
  Bottom 0.61: v87.95,54.29 v87.95,57.15
N$1  (via drill 0.4)
  Top 0.406: IC7.2 59.37,29.53 65.72,23.18 65.72,17.78 66.36,17.14 70.17,17.14 71.44,18.41 71.44,22.54 71.93,23.03 J13.2 74.99,23.18 | v73.66,23.18 v74.61,23.18 74.99,23.18 | v76.52,23.18 v75.56,23.18 74.99,23.18
N$2
  Top 0.406: LED3.A 8.19,32 R19.2
N$4
  Top 0.203: IC6.33 46.63,61.95 44.77,63.82
  Top 0.305: 44.77,65.25 44.77,63.82 | 44.77,65.25 46.04,66.52 46.58,66.52 Q2.3 | 44.77,65.25 41.75,65.25 40.96,66.04 C7.2
N$5
  Top 0.406: R10.1 R12.2 45.4,32.7 45.64,32.94 IC2.3
N$6  (via drill 0.4)
  Top 0.203: 18.57,11.08 L1.2 18.37,10.79 | IC1.28 18.03,14.99 18.34,14.68 18.34,14.29 19.05,13.57
  Top 0.305: 19.05,13.57 19.05,11.48 L1.2 | v17.46,10.48 17.78,10.79 18.37,10.79 | 26.68,11.1 v26.67,11.11
  Top 0.406: J3.GND 26.68,11.1
  Bottom 0.406: J5.1 15.21,11.27 15.95,11.27 16.75,10.48 v17.46,10.48 26.04,10.48 v26.67,11.11 | v26.67,11.11
N$7  (via drill 0.4)
  Top 0.305: IC11.2 IC11.1 | IC13.1 27.3,44.77 28.57,43.5 28.57,40.64 27.3,39.37 IC11.2 | v25.08,39.37 IC11.2
  Top 0.406: IC13.1 IC13.2 25.4,45.72 25.08,46.04 25.08,46.99 26.03,47.94 R42.1 | v25.08,32.07 33.34,32.07 34.92,30.48 36.2,30.48 36.87,29.81 36.87,28.3 33.34,24.77 33.34,17.78 36.2,14.92 S2.1
  Bottom 0.406: v25.08,32.07 v25.08,39.37
N$8
  Top 0.559: IC3.1 IC3.8 | IC3.8 IC3.7 | IC3.8 52.39,21.78 R18.2
N$9  (via drill 0.4)
  Top 0.406: J13.5 71.51,15.63 71.12,15.24 65.41,15.24 v62.55,18.1 | IC7.4 61.91,30.48 v62.55,29.84 | v73.66,15.56 v74.61,15.56 74.61,15.63 J13.5 | J13.5 76.52,15.63 v76.52,15.56 | J13.5 75.56,15.63 v75.56,15.56
  Bottom 0.406: v62.55,18.1 v62.55,29.84
N$10
  Top 0.406: R26.2 LED6.A
N$11
  Top 0.559: IC3.3 54.93,9.59 C11.1
N$12
  Top 0.61: J20.1 J19.2
N$13
  Top 0.508: R21.1 57.79,15.55 58.1,15.24 R20.2
  Top 0.61: R21.1 56.27,17.46 IC3.5
N$16
  Top 0.61: LED8.A 6.6,58.67 6.99,59.05 R36.2
N$17
  Top 0.305: R41.1
  Top 0.406: IC10.2 30.32,58.42 30.64,58.74 R41.1 R30.2
N$18  (via drill 0.4, 0.6)
  Top 0.406: R26.1 67.94,9.84 v61.28,16.51 | IC7.10 65.8,36.83 64.85,35.88 63.5,35.88 v61.28,33.66
  Bottom 0.406: v61.28,16.51 v61.28,33.66
N$19  (via drill 0.4)
  Top 0.406: LED6.C 74.61,2.22 79.06,6.67 v79.06,9.84 79.06,22.86 76.52,25.4 | 76.52,25.4 75.56,25.4 | 75.56,25.4 75.12,25.4 J13.1 74.99,25.72 v74.61,25.72 v73.66,25.72 | IC7.6 64.45,30.8 67.31,27.94 v67.31,18.1 | 76.52,25.4 v76.52,25.72 | v75.56,25.72 75.56,25.4
  Bottom 0.406: v67.31,18.1 67.31,13.02 70.48,9.84 v79.06,9.84
N$21
  Top 0.305: 53.66,6.03 53.98,5.71
  Top 0.406: L2.P$1 53.66,5.4 53.98,5.71
  Top 0.508: IC3.2 53.66,10.79 53.34,10.48 53.34,7.94 53.66,7.62 53.66,6.03
  Top 1.27: D1.C 53.05,4.15 L2.P$1
N$22  (via drill 0.4)
  Top 0.305: IC5.4 29.85,38.41 v30.8,37.47
  Top 0.406: R22.2 10.16,39.69 9.21,38.73 v7.94,38.73 | v29.53,30.16 12.06,30.16 v11.11,29.21
  Bottom 0.61: v7.94,38.73 7.94,32.38 v11.11,29.21 | v29.53,30.16 29.53,36.2 v30.8,37.47
N$23
  Top 0.406: R22.1 6.35,41.27 5.4,42.23 LED4.A
N$24
  Top 0.305: 19.05,52.34 C18.1 18.36,52.38
  Top 0.508: 18.36,52.38 IC9.3
  Top 0.61: R38.1 19.05,52.34
N$25
  Top 0.406: IC14.3 81.6,42.86 82.55,41.91 J21.T+
N$26
  Top 0.305: R38.2
  Top 0.406: R37.1 C17.1 18.37,45.83 20.95,48.42 R38.2
N$28  (via drill 0.4)
  Top 0.406: R23.2 10.16,38.1 v11.27,39.21
  Top 0.61: v12.06,58.74 16.8,58.74 IC4.4
  Bottom 0.61: v11.27,39.21 11.27,57.94 v12.06,58.74
N$29
  Top 0.61: LED9.A 6.6,54.23 6.99,54.61 R33.1
N$30
  Top 0.406: LED5.A 6.41,37.4 6.99,36.83 R23.1
N$31  (via drill 0.4)
  other vias: 29.53,2.54
N$32  (via drill 0.4)
  other vias: 30.16,3.17
N$33
  Top 0.61: LED7.A 6.6,49.78 6.99,50.16 R27.1
N$35
  Top 0.61: R34.2 J17.3
N$36
  Top 0.203: IC6.34 46.13,61.5 45.32,62.31 C8.2 43.5,62.67 | 43.5,64.14 43.04,64.14
  Top 0.305: 43.04,64.14 Q2.1 42.88,64.29 42.39,64.29
  Top 0.406: 43.5,62.67 43.5,64.14
N$38
  Top 0.203: 49.13,40.56 IC6.98
  Top 0.305: 49.13,40.56 47.94,39.37 44.77,39.37 44.13,38.73 C13.2
N$83  (via drill 0.4)
  other vias: 79.38,33.02
N$84  (via drill 0.4)
  other vias: 80.01,33.66
N$85  (via drill 0.4)
  other vias: 94.61,33.02
N$86  (via drill 0.4)
  other vias: 95.25,33.66
N$94
  Top 0.203: IC1.2 16.17,18.63
  Top 0.254: 16.17,18.63 16.75,19.21 16.75,19.29 R9.1
  Top 0.305: R9.1 17.15,20.64 18.73,22.23 18.73,23.08 Q1.3 16.87,23.14 16.13,23.88 C1.2
N$95
  Top 0.203: IC1.1 16.67,18.1 16.99,18.41
  Top 0.254: 16.99,18.41 20,18.41 20.8,19.21 20.8,19.29 R11.1
N$96
  Top 0.305: 22.49,25.34 22.91,25.77 | 22.86,19.92 R11.2 23.1,20.72 22.86,20.95 21.27,20.95 20.51,21.72 | R9.2 19.05,21.19 19.57,21.72 20.51,21.72 | 22.49,25.34 Q1.1 | 22.49,25.34 22.42,25.27 21.94,25.27 20.51,23.84 20.51,21.72
  Top 0.406: 22.91,25.77 C2.2
N$97  (via drill 0.4)
  Top 0.406: v29.21,16.83 F1.1 | J3.VBUS 23.48,10.25 v22.15,11.59
  Bottom 0.406: v29.21,16.83 27.38,16.83 v22.15,11.59
N$98
  Top 0.254: Z1.2 25.45,12.34 23.81,13.97 23.81,15.24 24.13,15.56 24.13,16.27 R16.2 24.45,16.59
  Top 0.406: 24.13,16.43 R16.2 | J3.D+ 25.08,10.48 25.72,11.11 Z1.2
N$100
  Top 0.203: 16.83,11.75 18.1,11.75 18.34,11.99 18.34,13.41 17.86,13.89 17.86,14.29 17.66,14.49 IC1.27
  Top 0.254: 16.43,9.67 16.43,11.35 16.83,11.75
  Top 0.305: C6.1 17.16,7.37 16.43,8.1 16.43,9.67
N$101
  Top 0.406: J3.D- 24.28,10.96 23.81,11.43 Z1.1 22.22,13.93 R14.2
N$103
  Top 0.203: IC1.30 18.37,15.99
  Top 0.254: 18.37,15.99 18.89,16.51 R14.1
N$104  (via drill 0.4)
  Top 0.203: IC1.29 18.24,15.49
  Top 0.254: 18.24,15.49 v19.21,14.53
  Top 0.406: v25.72,18.34 | v25.72,18.34 26.19,17.86 26.19,16.75 R16.1
  Bottom 0.406: v19.21,14.53 21.91,14.53 v25.72,18.34
N$105
  Top 0.406: LED2.C R15.1
N$107  (via drill 0.4)
  Top 0.61: v34.92,24.45 C3.1 | v33.02,28.26 v33.02,26.35
  Bottom 0.406: J2.2 13.14,24.26 17.54,28.65 32.62,28.65 v33.02,28.26 | v33.02,26.35 v34.92,24.45
N$109  (via drill 0.4)
  Top 0.203: IC1.13 11.92,14.99
  Top 0.254: 11.92,14.99 v11.67,15.24
  Bottom 0.203: v11.67,15.24 11.43,15 10.48,15 9.84,15.64 9.84,16.19 10.32,16.67 11.43,16.67 13.41,18.65
  Bottom 0.254: 12.89,22.73 13.02,22.86 J2.1 13.02,20.95 13.41,20.56 13.41,18.65
  Bottom 0.305: J2.1
N$110
  Top 0.203: 11.95,15.99 IC1.11
  Top 0.254: R13.2 14.29,11.35 13.97,11.67 11.19,11.67 9.37,13.49 9.37,15.64 10.08,16.35 | 11.95,15.99 11.11,16.83 10.56,16.83 10.08,16.35 | 10.08,16.35
N$111
  Top 0.203: IC1.10 12.16,16.49 11.35,17.3
  Top 0.254: 11.43,10.47 R15.2 11.67,10.48 8.89,13.26 8.89,15.95 9.53,16.59 10.24,17.3 11.35,17.3
N$116
  Top 0.406: LED1.C R13.1
N$120  (via drill 0.4)
  Top 0.254: 29.53,8.89 29.53,8.59 J3.SH4 | 20.42,8.68 20,8.26 20.3,8.26 J3.SH3 | Z1.3 24.77,14.29
  Top 0.305: 18.76,9.4 L1.1 | 24.77,14.29 25.72,14.29 29.53,10.48 29.53,8.89
  Top 0.406: 18.76,9.4 19.18,9.4 20,8.57 20.54,8.57 J3.SH3 20.58,8.57 v20.95,8.57 20.95,9.21 v20.64,9.21 | v30.16,8.57 29.58,8.57 J3.SH4 29.53,8.53 v29.53,7.94 | J3.SH2 20.32,3.03 v20.32,2.54
  Top 1.016: J3.SH3 J3.SH2 20.64,3.09 20.64,3.17 v20.95,3.17 29.53,3.17 | J3.SH4 J3.SH1 29.58,3.12 29.53,3.17 | 29.53,3.17 29.53,3.49
RXD3  (via drill 0.4)
  Top 0.203: IC6.63 34.61,52.07 34.29,51.75
  Top 0.254: 34.29,51.75 34.29,51.59 v33.5,50.8
  Bottom 0.305: v33.5,50.8 33.02,50.8 32.38,51.44 32.38,55.56 26.99,60.96 23.18,60.96 20.32,58.1 19.21,58.1 18.41,58.9 18.41,60.64 16.83,62.23 14.92,62.23
  Bottom 0.406: 14.92,62.23 14.43,62.23 J15.1
SCK  (via drill 0.4)
  Top 0.203: IC6.20 48.89,55.57 v47.31,57.15
  Top 0.305: 64.45,58.42 v89.22,58.42 90.49,58.42 94.93,62.87 96.76,62.87 J11.7
  Top 0.406: v82.87,53.02 IC14.5 | IC7.5 63.18,34.29 63.98,35.08 65.17,35.08 66.99,36.91 IC7.9 67.21,37.68 67.94,38.42 87,38.42 89.22,40.64 v89.22,54.29 | 64.45,58.42 J14.3
  Bottom 0.305: v47.31,57.15 48.9,55.56 58.74,55.56 61.91,58.74
  Bottom 0.406: v82.87,53.02 87.95,53.02 v89.22,54.29 | 61.91,58.74 J14.3
  Bottom 0.61: v89.22,54.29 v89.22,58.42
SCL  (via drill 0.4)
  Top 0.203: IC6.43 41.63,59.02 v43.5,57.15
  Bottom 0.203: 40.96,57.15 41.59,56.52 42.86,56.52 v43.5,57.15
  Bottom 0.406: 40.96,57.15 37.47,60.64 36.65,61.45 J12.2
SDA  (via drill 0.4 pad 0.25)
  Top 0.203: IC6.44 41.13,58.24 v42.23,57.15
  Bottom 0.406: v42.23,57.15 40.64,58.74 39.55,59.83 J12.1
TXD3  (via drill 0.4)
  Top 0.203: IC6.64 35.06,51.57 34.61,51.12
  Top 0.254: v34.61,50.48 34.61,51.12
  Bottom 0.305: v34.61,50.48 33.97,49.85 33.02,49.85 31.75,51.12 31.75,55.24 26.59,60.4 23.65,60.4 20.64,57.47
  Bottom 0.406: J15.2 18.91,57.47 20.64,57.47
UI_RXD  (via drill 0.4)
  Top 0.203: v41.59,53.98 40.63,54.94 IC6.45
  Bottom 0.305: v41.59,53.98 42.86,52.7 55.56,52.7 56.83,51.44 92.71,51.44 93.98,52.7 96.76,52.7 J11.3
UI_TXD  (via drill 0.4)
  Top 0.203: v40.4,54.05 39.85,54.61 39.85,55.09 40.13,55.37 IC6.46
  Bottom 0.305: v40.4,54.05 41.2,54.85 42.62,54.85 44.13,53.34 56.2,53.34 57.47,52.07 92.08,52.07 95.25,55.24 96.76,55.24 J11.4
USB_RXD  (via drill 0.4)
  Top 0.203: 53.44,46.57 IC6.2 | 12.62,17.7 IC1.9
  Top 0.254: v11.67,18.65 12.62,17.7
  Top 0.305: 53.44,46.57 54.93,45.09 v54.93,40.8
  Bottom 0.203: 8.81,15.8 8.81,16.43 11.03,18.65 v11.67,18.65
  Bottom 0.254: 8.81,15.8 8.81,10.16 9.45,9.53 18.89,9.53 20.64,7.78 27.3,7.78 29.21,9.68 29.21,15.56 30.8,17.14 31.43,17.14
  Bottom 0.305: v54.93,40.8 54.93,38.1 48.58,31.75 48.58,18.41 47.31,17.14 31.43,17.14
USB_TXD  (via drill 0.4)
  Top 0.203: 54.21,47.07 IC6.3 | 13.17,18.5 IC1.8
  Top 0.254: v11.83,19.84 13.17,18.5
  Top 0.305: 54.21,47.07 56.2,45.09 v56.2,40.8
  Bottom 0.254: 31.11,16.19 30.16,15.24 30.16,9.92 27.46,7.22 20.4,7.22 18.73,8.89 8.89,8.89 8.26,9.53 8.26,16.51 11.59,19.84 v11.83,19.84
  Bottom 0.305: v56.2,40.8 56.2,38.1 49.53,31.43 49.53,18.1 47.62,16.19 31.11,16.19
USBVCC
  Top 0.203: IC1.31 18.08,16.49
  Top 0.254: 18.08,16.49 19.45,17.86 23.89,17.86 25.24,19.21 27.94,19.21 28.18,18.97 | 28.94,19.05 F1.2 28.37,18.78 28.18,18.97 | 28.18,18.97
WP  (via drill 0.4)
  Top 0.406: J13.WP 94.61,4.53 v94.61,4.13 | 94.61,4.85 94.88,4.85 J13.WP | v95.25,5.08 94.88,4.76 J13.WP
X_DIR  (via drill 0.4)
  Top 0.203: 52.39,58.1 52.39,58.74
  Top 0.305: IC6.25 52.35,58.07 52.39,58.1
  Top 0.406: v53.34,63.18 52.39,62.23 52.39,58.74
  Top 0.61: R2.1 51.75,67.63 52.39,68.26 J1.2
  Bottom 0.61: v53.34,63.18 53.34,66.67 52.39,67.63 J1.2
X_HOME  (via drill 0.4)
  Top 0.203: 48.13,45.27 IC6.96
  Top 0.305: v47.62,50.48 48.13,49.98 48.13,45.27 | R31.1 27.3,66.99 27.94,67.63 30.48,67.63 J16.2
  Top 0.61: v29.21,65.09 R31.1 | LED7.C 6.73,51.82 v7.94,53.02
  Bottom 0.305: J16.2 34.61,57.78 40.32,52.07 46.04,52.07 v47.62,50.48
  Bottom 0.406: v29.21,65.09 27.94,63.82 10.95,63.82 9.21,62.07 9.21,55.24 7.94,53.98 v7.94,53.02
X_STEP  (via drill 0.4)
  Top 0.203: IC6.18 54.89,54.57
  Top 0.305: 54.89,54.57 55.56,55.24 v55.56,57.78
  Top 0.61: J1.1 54.93,68.34 54.29,67.71 R4.1 | v54.93,60.01 v54.93,62.47
  Bottom 0.61: v55.56,57.78 54.93,58.42 v54.93,60.01 | v54.93,62.47 J1.1
Y_DIR  (via drill 0.4)
  Top 0.203: IC6.24 53.84,57.57 55.96,59.69
  Top 0.305: v70.17,67.79 69.53,67.15 58.1,67.15 55.96,65.01 55.96,59.69
  Top 0.61: v70.17,67.79 J4.2 | R6.1 78.11,62.55 76.2,64.45 v70.17,64.45
  Bottom 0.61: v70.17,67.79 v70.17,64.45
Y_HOME  (via drill 0.4)
  Top 0.203: 47.13,45.34 IC6.94
  Top 0.305: v46.12,49.37 47.13,48.44 47.13,45.34 | R32.1
  Top 0.61: v22.54,65.09 R32.1 | R32.1 v24.45,67.07 J18.2 | LED9.C 7.05,56.26 v7.94,57.15
  Bottom 0.305: v46.12,49.37 44.77,50.8 40.32,50.8 30.8,60.33 30.8,65.72 29.45,67.07 v24.45,67.07
  Bottom 0.61: v7.94,57.15 7.94,62.55 10.48,65.09 v22.54,65.09
Y_STEP  (via drill 0.4)
  Top 0.203: IC6.17 55.42,54.07
  Top 0.305: 55.42,54.07 56.59,55.24 56.59,64.77 58.42,66.6 71.99,66.6 v72.71,67.31 | R5.1
  Top 0.406: v68.9,62.55 R5.1
  Top 0.61: v72.71,67.31 J4.1
  Bottom 0.61: v72.71,67.31 72.71,64.45 R5.1 v68.9,62.55
Z_DIR  (via drill 0.4)
  Top 0.203: IC6.7 55.7,49.07
  Top 0.305: v87.95,67.31 86.68,66.04 58.74,66.04 57.15,64.45 57.15,50.16 56.05,49.07 55.7,49.07
  Top 0.61: v87.95,67.31 J7.2 | v87.95,64.45 R8.1
  Bottom 0.61: v87.95,67.31 v87.95,64.45
Z_HOME  (via drill 0.4)
  Top 0.203: 46.13,45.42 IC6.92
  Top 0.305: 46.13,45.42 46.13,46.9 v44.77,48.26
  Top 0.406: R35.2 19.36,65.08 v20.64,66.36
  Top 0.61: J17.4 R39.1 6.35,65.08 5.4,64.14 LED8.C
  Bottom 0.305: v44.77,48.26 43.5,49.53 40.32,49.53 30.16,59.69 30.16,65.41 29.21,66.36 25.48,66.36 25.08,65.96 23.73,65.96 23.34,66.36 v20.64,66.36
  Bottom 0.406: J17.4 9.21,67.31 10.16,66.36 v20.64,66.36
Z_STEP
  Top 0.203: IC6.6 56.51,48.57 56.83,48.9
  Top 0.305: 89.22,65.41 59.05,65.41 57.78,64.14 57.78,49.85 56.83,48.9
  Top 0.61: J7.1 90.49,66.67 89.22,65.41 90.49,64.14 R7.1

## Text on the board
tPlace: Omron TL-Q5MC sensors | Leetro DMD402B optically-isolated stepper motor drivers | Laser Cutter Controller | 1 | (Arduino Compatible) | Luke Weston, 2011 | 1 | 1 | 1 | 1 | 1 | +
bPlace: Auto Reset | USB Gnd
tValues: 24V | GND | GND | IN | LEDA | +5V | +24V | GND | IN | +24V | GND | IN | +24V | +24V | GND | EN | +5V | DIR | STEP | +24V | GND | EN | +5V | DIR | STEP | +24V | GND | EN | +5V | DIR | STEP | !CS | SCK | SCL | SDA | MOSI | 1 | !STEP DIS | RX3 | TX3 | . | MISO | TXD | RXD | GND | USER INTERFACE | +5V | SPI/SERIAL: 5V LEVELS | TYPE-K | THERMOCOUPLE | TTLL | 1 | WP | GND | VIN | Laser Test | SD CARD | Reset